# EAGLE design page1 (EAGLE 7.0.0)
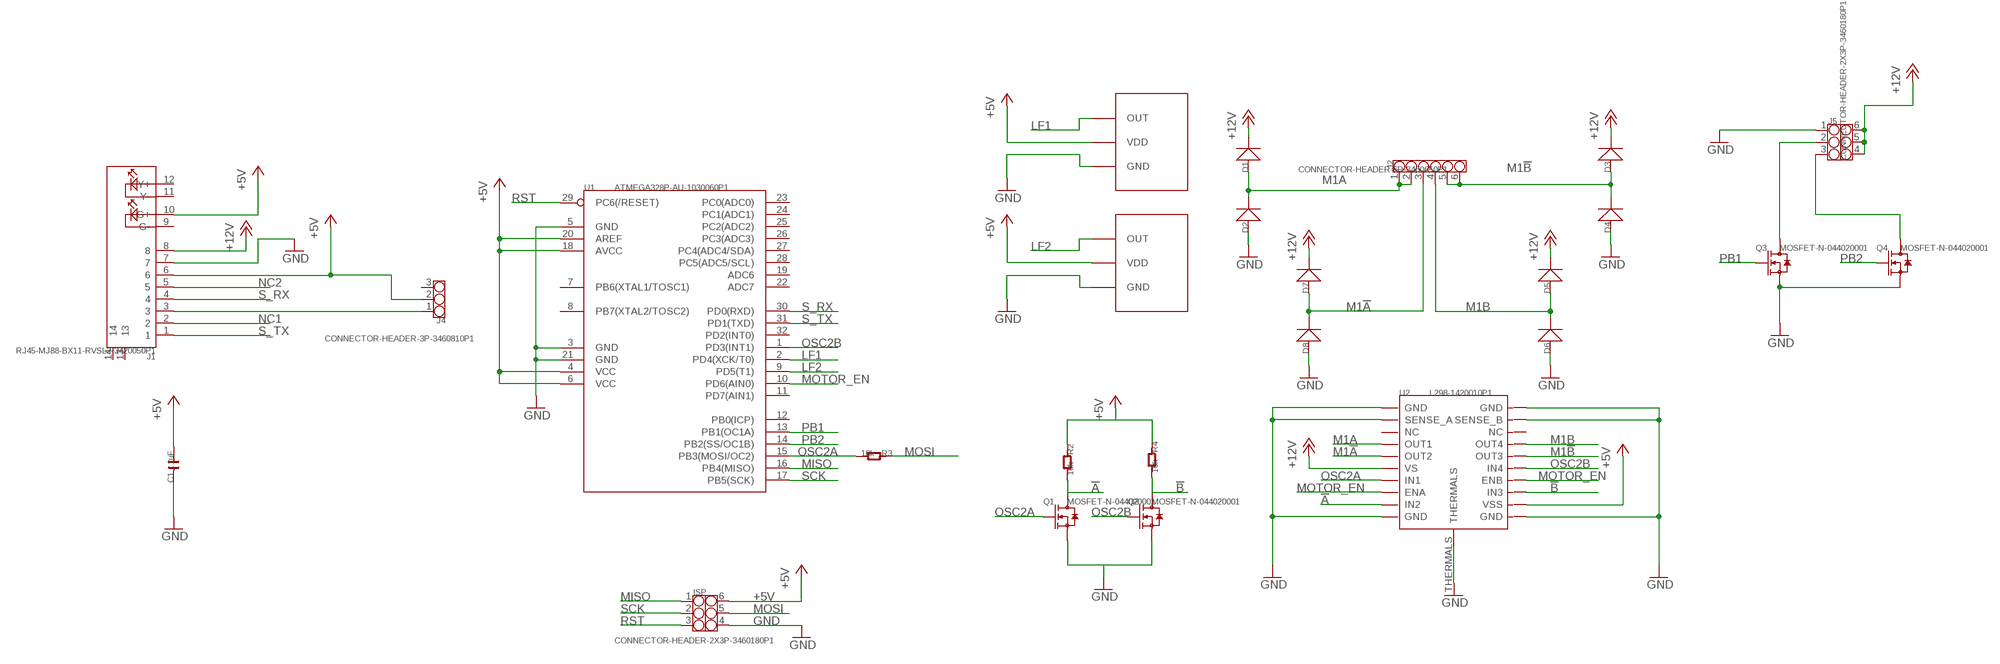
[diagram p0: schematic, sheet 1]

## Parts
C1  1uF  C-0805  [C0805]
D1  D-SMA  [DO-214AC]
D2  D-SMA  [DO-214AC]
D3  D-SMA  [DO-214AC]
D4  D-SMA  [DO-214AC]
D5  D-SMA  [DO-214AC]
D6  D-SMA  [DO-214AC]
D7  D-SMA  [DO-214AC]
D8  D-SMA  [DO-214AC]
ISP  CONNECTOR-HEADER-2X3P-3460180P1  [2X3P-2.54-2.54-11.6-3.0-BLACK-MALE]
J1  RJ45-MJ88-BX11-RVSL2-3420050P1  [RJ45-MJ88-BX11-RVSL2]
J2  CONNECTOR-HEADER-6P-3460650P1  [1X6P-2.54-2.54-11.6-3.0-BLACK-MALE]
J4  CONNECTOR-HEADER-3P-3460810P1  [1X3P-2.54-2.54-11.6-3.0-BLACK-MALE]
J5  CONNECTOR-HEADER-2X3P-3460180P1  [2X3P-2.54-2.54-11.6-3.0-BLACK-MALE]
Q1  MOSFET-N-044020001  [SOT23]
Q2  MOSFET-N-044020001  [SOT23]
Q3  MOSFET-N-044020001  [SOT23]
Q4  MOSFET-N-044020001  [SOT23]
R2  10k  R-0603  [R0603]
R3  10k  R-0603  [R0603]
R4  10k  R-0603  [R0603]
U1  ATMEGA328P-AU-1030060P1  [TQFP32]
U2  L298-1420010P1  [POWERSO-20]
U$5  TSL235  [TSL235R-2MM-S]
U$6  TSL235  [TSL235R-2MM-S]

## Nets
!A: Q1.3(D) R2.2 U2.9(IN2)
!B: Q2.3(D) R4.2 U2.13(IN3)
+5V [pwr12]: C1.2 ISP.6 J1.6 J1.10(G+) J4.2 R2.1 R4.1 U1.4(VCC) U1.6(VCC) U1.18(AVCC) U1.20(AREF) U2.12(VSS) U$5.P$2(VDD) U$6.P$2(VDD)
+12V [pwr12]: D1.2(-) D3.2(-) D5.2(-) D7.2(-) J1.8 J5.4 J5.5 J5.6 U2.6(VS)
GND: C1.1 D2.1(+) D4.1(+) D6.1(+) D8.1(+) ISP.4 J1.7 J5.1 Q1.2(S) Q2.2(S) Q3.2(S) Q4.2(S) U1.3(GND) U1.5(GND) U1.21(GND) U2.1(GND) U2.2(SENSE_A) U2.10(GND) U2.11(GND) U2.19(SENSE_B) U2.20(GND) U2.THERMALS U$5.P$1(GND) U$6.P$1(GND)
LF1: U1.2(PD4(XCK/T0)) U$5.P$3(OUT)
LF2: U1.9(PD5(T1)) U$6.P$3(OUT)
M1!A: D7.1(+) D8.2(-) J2.3 U2.5(OUT2)
M1!B: D3.1(+) D4.2(-) J2.5 J2.6 U2.16(OUT3)
M1A: D1.1(+) D2.2(-) J2.1 J2.2 U2.4(OUT1)
M1B: D5.1(+) D6.2(-) J2.4 U2.17(OUT4)
MISO: ISP.1 U1.16(PB4(MISO))
MOSI: ISP.5 R3.1
MOTOR_EN [pwr12]: U1.10(PD6(AIN0)) U2.8(ENA) U2.14(ENB)
N$1: J1.3 J4.1
N$3: J5.3 Q4.3(D)
N$4: J5.2 Q3.3(D)
NC1: J1.2
NC2: J1.5
OSC2A: Q1.1(G) R3.2 U1.15(PB3(MOSI/OC2)) U2.7(IN1)
OSC2B: Q2.1(G) U1.1(PD3(INT1)) U2.15(IN4)
PB1: Q3.1(G) U1.13(PB1(OC1A))
PB2: Q4.1(G) U1.14(PB2(SS/OC1B))
RST: ISP.3 U1.29(PC6(/RESET))
S_RX: J1.4 U1.30(PD0(RXD))
S_TX: J1.1 U1.31(PD1(TXD))
SCK: ISP.2 U1.17(PB5(SCK))
Unconnected: J1.9(G-) J1.11(Y-) J1.12(Y+) J1.13 J1.14 J4.3 U1.7(PB6(XTAL1/TOSC1)) U1.8(PB7(XTAL2/TOSC2)) U1.11(PD7(AIN1)) U1.12(PB0(ICP)) U1.19(ADC6) U1.22(ADC7) U1.23(PC0(ADC0)) U1.24(PC1(ADC1)) U1.25(PC2(ADC2)) U1.26(PC3(ADC3)) U1.27(PC4(ADC4/SDA)) U1.28(PC5(ADC5/SCL)) U1.32(PD2(INT0)) U2.3(NC) U2.18(NC)

## Library data of the parts
C1 = OPL Eagle Library:C*
D1-D8 = OPL Eagle Library:D*: DIODE
ISP J5 = OPL Eagle Library:CONNECTOR-HEADER-2X3P
J1 = OPL Eagle Library:RJ45-MJ88-BX11-RVSL2: Modular Jack 8P8C,R/A,With LED When you use the footprint ,place notice 46 (layer)milling ,there is some important information.
J2 = OPL Eagle Library:CONNECTOR-HEADER-6P
J4 = OPL Eagle Library:CONNECTOR-HEADER-3P
Q1-Q4 = OPL Eagle Library:MOSFET-N: CJ2302：SMD MOSFET N-CH 20V-2.1A
R2-R4 = OPL Eagle Library:R*
U1 = OPL Eagle Library:ATMEGA328P-AU: 8-bit AVR Microcontroller with 32K Bytes In-System Programmable Flash
U2 = OPL Eagle Library:L298: Dual Full-Bridge Driver http://www.sandorobotics.com/attachments/l298motores.pdf
U$5 U$6 = Chris_parts:TSL235

## Net classes
0 default: width 0.254 mm, clearance 0.254 mm
1 pwr12: width 0.305 mm, drill 0.61 mm, clearance 0.254 mm

## Board
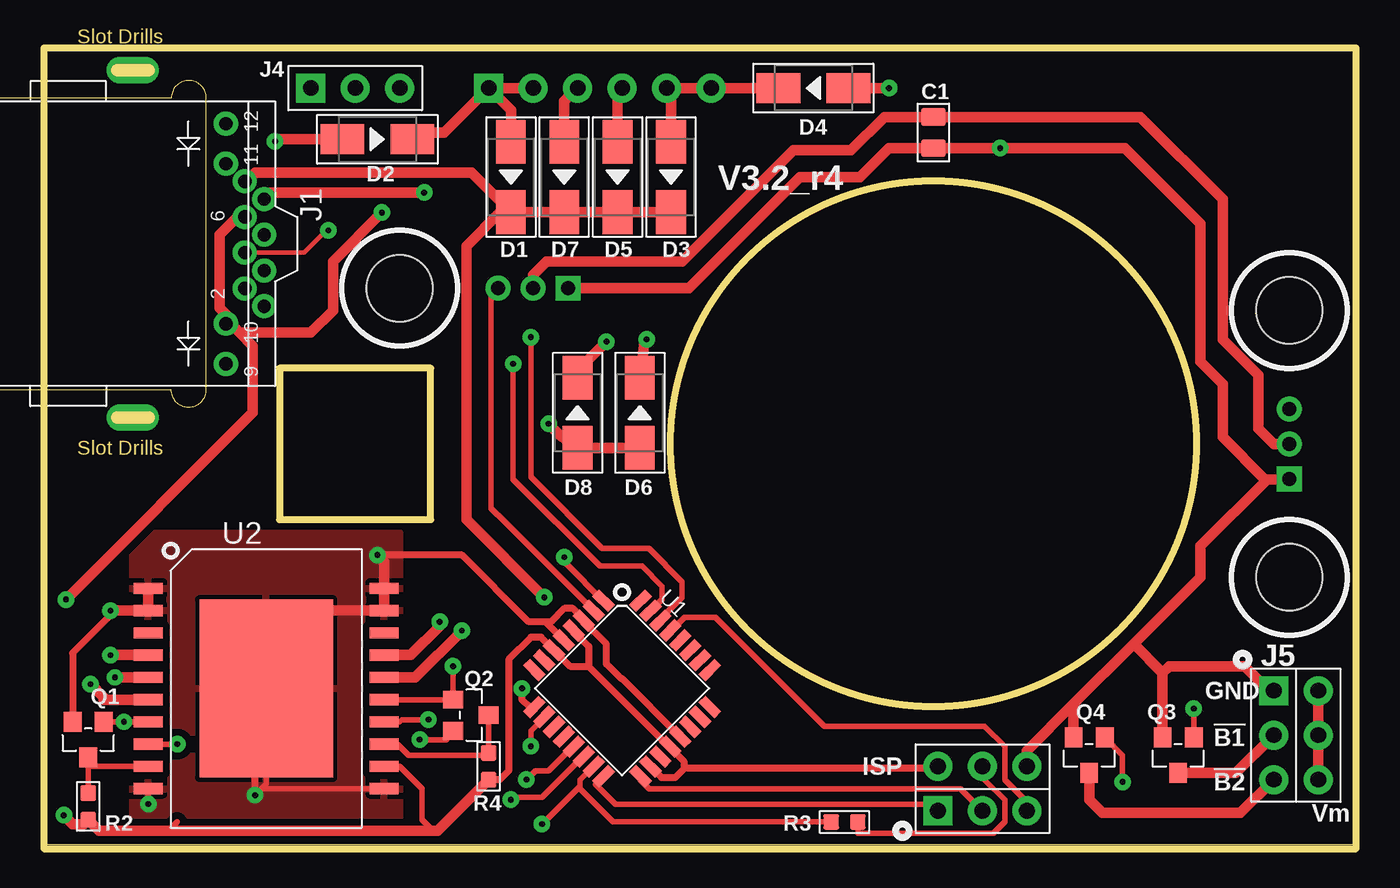
[diagram p1: board, top side]
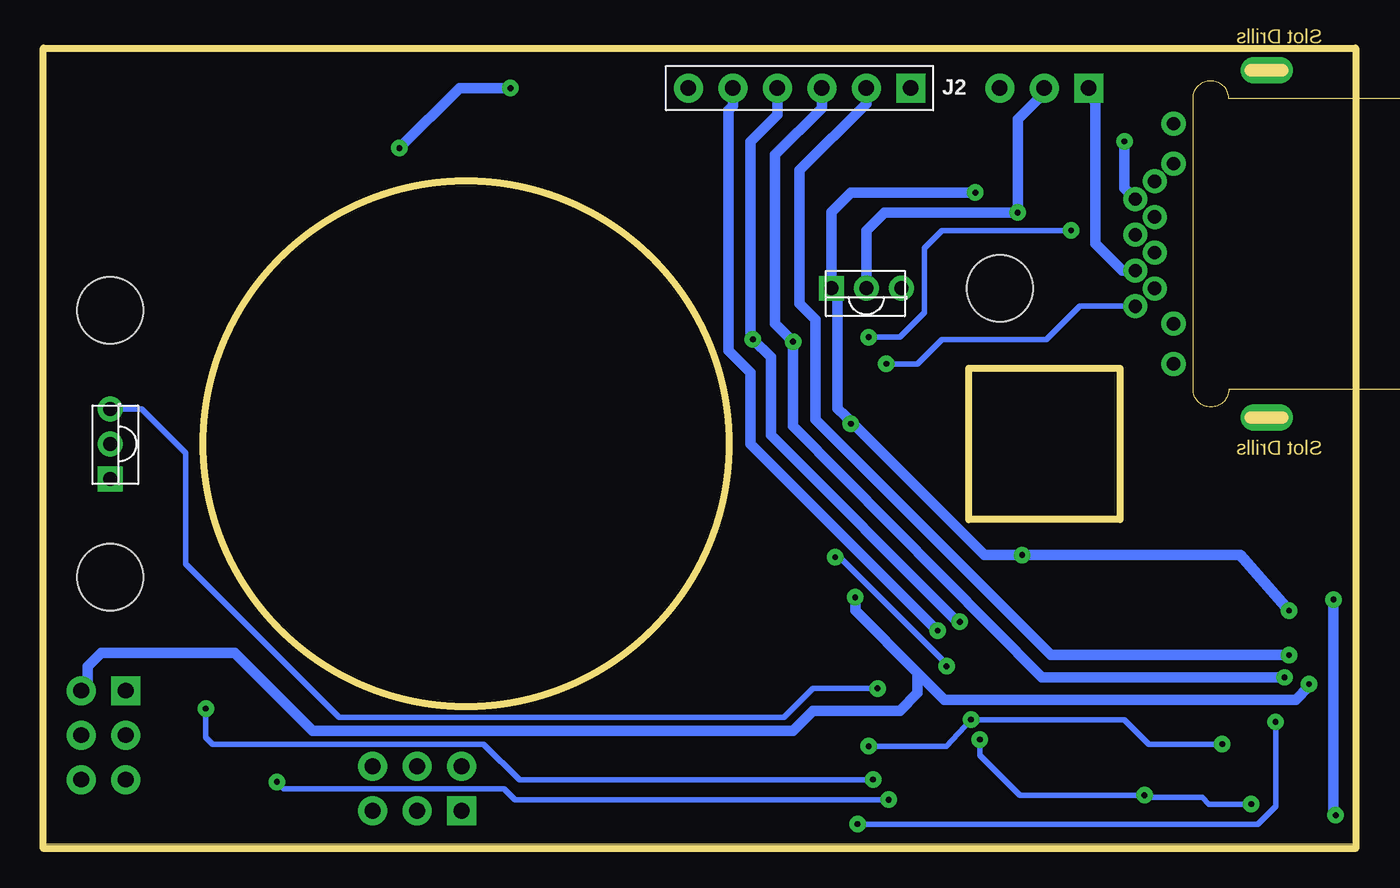
[diagram p2: board, bottom side, seen from below]

Size 74.91 x 45.39 mm. Coordinates in mm from the lower left corner, seen from the top.
Outline: 0,0 74.91,0 74.91,45.39 0,45.39 0,0
Copper layers (1*2*15*16): Top 0.035mm / dielectric 0.2mm / Route2 0.0175mm / dielectric 1.1mm / Route15 0.0175mm / dielectric 0.2mm / Bottom 0.035mm
Design rules "SeeedStudio_DRU_no_angle_20130527 *": minimum track width 6mil, minimum drill 12mil, track to track 6mil, track to pad 6mil, pad to pad 6mil, via to via 6mil, smd to smd 0mil, copper to edge 10mil, drill to drill 10mil, minimum pad ring 12mil, minimum via ring 12mil, stop-mask expansion 2mil, vias tented up to drill 25mil, thermal gap 10mil
Holes 3.8 mm at 20.32,31.75 71.12,30.48 71.12,15.24
Milling: area 35.8,7.9 to 65.8,37.9; 8 lines

### Footprints (pad centres in the part's own frame; a part is rotated, then mirrored left to right if it is on the bottom)
C0805 = smd 1.016 x 1.397: 1 -0.889,0; 2 0.889,0
DO-214AC = smd 2.5 x 1.7: 1 -2,0; 2 2,0
2X3P-2.54-2.54-11.6-3.0-BLACK-MALE = drill 0.889 pad 1.651 square: 1 -1.27,2.54 | drill 0.889 pad 1.651: 2 -1.27,0; 3 -1.27,-2.54; 4 1.27,-2.54; 5 1.27,0; 6 1.27,2.54
RJ45-MJ88-BX11-RVSL2 = drill 0.762 pad 1.27: 1 3.57,7.5; 2 2.55,6.4; 3 1.53,7.5; 4 0.51,6.4; 5 -0.51,7.5; 6 -1.53,6.4; 7 -2.55,7.5; 8 -3.57,6.4; 9 6.86,5.32; 10 4.57,5.32; 11 -4.57,5.32; 12 -6.86,5.32 | drill 0.6 pad 1.5 long: 13 -9.92,0; 14 9.92,0
1X6P-2.54-2.54-11.6-3.0-BLACK-MALE = drill 0.889 pad 1.651 square: 1 0,6.35 | drill 0.889 pad 1.651: 2 0,3.81; 3 0,1.27; 4 0,-1.27; 5 0,-3.81; 6 0,-6.35
1X3P-2.54-2.54-11.6-3.0-BLACK-MALE = drill 0.889 pad 1.651 square: 1 0,2.54 | drill 0.889 pad 1.651: 2 0,0; 3 0,-2.54
SOT23 = smd 1.016 x 1.143: 1 -0.889,-1.016; 2 0.889,-1.016; 3 0,1.016
R0603 = smd 0.889 x 0.889: 1 -0.762,0; 2 0.762,0
TQFP32 = smd 1.27 x 0.559: 1 -4.293,2.8; 2 -4.293,2; 3 -4.293,1.2; 4 -4.293,0.4; 5 -4.293,-0.4; 6 -4.293,-1.2; 7 -4.293,-2; 8 -4.293,-2.8; 17 4.293,-2.8; 18 4.293,-2; 19 4.293,-1.2; 20 4.293,-0.4; 21 4.293,0.4; 22 4.293,1.2; 23 4.293,2; 24 4.293,2.8 | smd 0.559 x 1.27: 9 -2.8,-4.293; 10 -2,-4.293; 11 -1.2,-4.293; 12 -0.4,-4.293; 13 0.4,-4.293; 14 1.2,-4.293; 15 2,-4.293; 16 2.8,-4.293; 25 2.8,4.293; 26 2,4.293; 27 1.2,4.293; 28 0.4,4.293; 29 -0.4,4.293; 30 -1.2,4.293; 31 -2,4.293; 32 -2.8,4.293
POWERSO-20 = smd 1.651 x 0.635: 1 -6.731,5.715; 2 -6.731,4.445; 3 -6.731,3.175; 4 -6.731,1.905; 5 -6.731,0.635; 6 -6.731,-0.635; 7 -6.731,-1.905; 8 -6.731,-3.175; 9 -6.731,-4.445; 10 -6.731,-5.715; 11 6.731,-5.715; 12 6.731,-4.445; 13 6.731,-3.175; 14 6.731,-1.905; 15 6.731,-0.635; 16 6.731,0.635; 17 6.731,1.905; 18 6.731,3.175; 19 6.731,4.445; 20 6.731,5.715 | smd 7.62 x 10.16: THERMALS 0,0
TSL235R-2MM-S = drill 0.8 square: P$1 -2,0 | drill 0.8 pad 1.422: P$2 0,0; P$3 2,0

### Placement (x,y rotation side)
C1  50.8,40.64 90 top
D1  26.67,38.1 270 top
D2  19.05,40.26 0 top
D3  35.81,38.1 270 top
D4  43.94,43.18 180 top
D5  32.77,38.1 270 top
D6  34.04,24.64 90 top
D7  29.72,38.1 270 top
D8  30.48,24.64 90 top
ISP  53.59,3.17 90 top
J1  5.08,34.29 270 top
J2  31.75,43.18 270 bottom
J4  17.78,43.18 90 top
J5  71.5,6.22 0 top
Q1  2.54,5.97 180 top
Q2  24.38,7.37 270 top
Q3  64.77,5.08 180 top
Q4  59.69,5.08 180 top
R2  2.54,2.16 90 top
R3  45.72,1.27 180 top
R4  25.4,4.45 90 top
U1  33.02,8.89 315 top
U2  12.7,8.89 0 top
U$5  27.94,31.75 0 bottom
U$6  71.12,22.86 90 bottom

### Tracks (layer width: path | path; a pad name or v marks a point on that pad's centre or on a via)
!A
  Top 0.305: Q1.3 2.54,4.45 | R2.2 2.54,3.94 2.54,4.45 | U2.9 2.54,4.45
!B
  Top 0.305: Q2.3 R4.2 25.02,5.08 20.83,5.08 20.19,5.71 U2.13
+5V  (via drill 0.33)
  Top 0.305: J1.6 | 10.67,29.72 J1.10 | U2.12 20.32,4.45 21.59,3.17 21.59,1.4 22.23,0.76 | 7.62,1.27 7.11,0.76
  Top 0.406: 31.11,10.16 30.05,10.16 U1.6 28.4,11.81 27.81,11.81 26.54,10.54 26.54,4.19 26.04,3.68 R4.1 25.53,3.81 | U1.18 35.27,3.81 36.07,3.81 36.58,4.32 | 36.58,4.32 36.58,4.7 35.77,5.5 U1.20 35.7,5.57 31.11,10.16 | U1.4 30.21,12.21 31.11,11.3 31.11,10.16 | 36.58,4.32 50.93,4.32 ISP.6
  Top 0.61: J1.6 11.05,35.81 10.03,34.8 10.03,30.61 10.4,30.24 J1.10 | U$6.P$2 70.23,22.86 69.34,23.75 69.34,26.8 67.31,28.83 67.31,36.83 62.61,41.53 C1.2 48.01,41.53 46.1,39.62 42.8,39.62 36.45,33.27 28.7,33.27 27.94,32.51 U$5.P$2 | 10.67,29.72 11.18,29.21 | 11.18,29.21 15.24,29.21 16.51,30.48 16.51,33.27 v19.3,36.07 | 11.18,29.21 11.94,28.45 11.94,24.64 v1.27,13.97 | R4.1 22.48,0.76 22.23,0.76 7.11,0.76 3.17,0.76 R2.1 2.29,1.14 1.65,1.14 v1.14,1.65
  Bottom 0.61: U$5.P$2 27.94,35.05 26.92,36.07 v19.3,36.07 19.3,41.4 18.03,42.67 J4.2 | v1.27,13.97 1.27,1.91 v1.14,1.65
+12V  (via drill 0.33, 0.33 pad 0.25)
  Top 0.61: D7.2 D1.2 24.42,38.35 12.06,38.35 11.57,37.86 J1.8 | D7.2 D5.2 D3.2 | J5.6 J5.5 J5.4 | D7.2 26.07,36.1 24.13,34.16 24.13,18.54 v28.57,14.1 | v2.67,9.14 3.43,8.38 3.43,8.26 U2.6
  Bottom 0.61: v28.57,14.1 28.57,13.34 25.02,9.78 | 25.02,9.78 25.02,8.64 26.04,7.62 30.99,7.62 32.13,6.48 59.56,6.48 64.01,10.92 71.63,10.92 72.39,10.16 72.39,9.14 J5.6 | 25.02,9.78 23.5,8.26 3.43,8.26 2.67,9.02 v2.67,9.14
GND  (via drill 0.33)
  Top 0.305: v5.97,2.29 U2.10 | U2.THERMALS 12.7,3.43 v12.06,2.79 12.45,3.17 U2.11 | Q2.2 22.99,5.97 v21.46,5.97 | U1.21 36.41,6.14
  Top 0.406: 29.63,11.64 U1.5 28.64,12.7 | U1.21 33.02,9.46 32.96,9.46 32.13,10.29 32.13,11.43 30.83,12.73 U1.3 | U1.3 30.91,12.77 | U1.3 30.83,12.86 30.23,13.46 29.72,13.46 28.96,12.7 28.64,12.7 | 28.64,12.7 27.69,12.7 23.88,16.51 v19.05,16.51 | v12.06,2.79 12.06,4.45 10.16,6.35 | v3.81,13.34 3.81,13.08 1.65,10.92 Q1.2
  Top 0.61: J1.7 12.95,37.21 v21.72,37.21 | v19.05,16.51 19.43,16.13 U2.20 U2.19 16.13,13.34 12.7,10.16 U2.THERMALS | U2.1 U2.2 v3.81,13.34 | Q1.2 1.78,7.11 | U$6.P$1 71.09,20.83 69.85,20.83 | 69.85,20.83 69.72,20.83 67.31,23.24 67.31,26.29 66.04,27.56 66.04,35.43 61.72,39.75 v54.61,39.75 C1.1 48.26,39.75 46.61,38.1 43.18,38.1 36.83,31.75 U$5.P$1 | D2.1 13.34,40.26 v13.21,40.13 | D4.1 v48.26,43.18 | v28.83,24 29.43,23.4 D8.1 D6.1 | ISP.4 56.13,5.33 58.8,8 | 58.8,8 62.23,11.43 | 62.23,11.43 66.04,15.24 66.04,17.02 69.85,20.83 | Q3.2 63.88,9.78 | 63.88,9.78 62.23,11.43 | Q4.2 58.8,8 | J5.1 69.98,8.76 68.58,10.16 64.26,10.16 63.88,9.78
  Bottom 0.305: 11.94,2.67 8.76,2.67 8.38,2.29 v5.97,2.29 | v21.46,5.97 21.46,5.08 19.18,2.79 v12.06,2.79
  Bottom 0.406: 11.94,2.67 12.06,2.67 v12.06,2.79
  Bottom 0.61: v21.72,37.21 28.83,37.21 29.94,36.1 U$5.P$1 29.59,31.4 29.59,24.89 29.15,24.45 | 29.15,24.45 21.21,16.51 v19.05,16.51 6.6,16.51 v3.81,13.34 | v13.21,40.13 13.21,37.47 J1.7 | v48.26,43.18 51.18,43.18 v54.61,39.75 | v28.83,24 29.15,24.45
  pour Top (isolate 0.406): 5.08,17.78 20.32,17.78 20.32,1.27 5.08,1.27
LF1
  Top 0.305: U1.2 25.94,18.8 25.91,18.8 25.53,19.18 25.53,31.34 U$5.P$3
LF2  (via drill 0.33)
  Top 0.406: U1.9 27.73,7.83 27.3,8.26 v27.3,8.89
  Bottom 0.305: U$6.P$3 69.31,24.86 66.8,22.35 66.8,16 58.04,7.24 32.64,7.24 30.99,8.89 v27.3,8.89
M1!A  (via drill 0.33)
  Top 0.61: U2.5 v4.06,9.53 | D7.1 29.72,42.42 J2.3 | D8.2 30.83,27.4 v32.13,28.7
  Bottom 0.61: v4.06,9.53 17.91,9.53 32.13,23.88 v32.13,28.7 33.15,29.72 33.15,39.37 30.48,42.04 J2.3
M1!B  (via drill 0.33)
  Top 0.61: U2.16 21.21,9.53 v23.88,12.19 | D4.2 J2.6 J2.5 35.81,42.93 D3.1
  Bottom 0.61: v23.88,12.19 34.54,22.86 34.54,26.92 35.81,28.19 35.81,41.91 35.56,42.16 J2.5
M1A  (via drill 0.33)
  Top 0.61: U2.4 v3.81,10.79 | D1.1 26.67,41.91 J2.1 | D2.2 21.43,40.64 22.86,40.64 J2.1 | J2.2 J2.1
  Bottom 0.61: v3.81,10.79 17.4,10.79 30.86,24.26 30.86,29.97 31.75,30.86 31.75,38.48 27.94,42.29 J2.2
M1B  (via drill 0.33)
  Top 0.61: U2.17 20.95,10.79 22.61,12.45 v22.61,12.7 | D6.2 34.29,28.7 v34.42,28.83 | D5.1 32.77,42.93 J2.4
  Bottom 0.61: v22.61,12.7 22.73,12.7 33.4,23.37 33.4,27.81 v34.42,28.83 34.54,29.21 34.54,40.13 33.02,41.66 J2.4
MISO
  Top 0.305: U1.16 31.94,3.88 31.5,3.43 32.64,2.29 50.67,2.29
  Top 0.406: 50.67,2.29 ISP.1
MOSI
  Top 0.305: R3.1 46.48,0.64 54.23,0.64 54.86,1.27 54.86,2.54 53.72,3.68 53.72,4.32 ISP.5
MOTOR_EN  (via drill 0.33)
  Top 0.305: U1.10 28.57,7.23 27.81,6.48 v27.81,5.59 | v21.97,7.11 20.45,7.11 20.32,6.99 U2.14 | U2.8 v7.62,5.71
  Bottom 0.305: v27.81,5.59 23.37,5.59 v21.97,7.11 13.21,7.11 11.81,5.71 v7.62,5.71
N$1
  Bottom 0.61: J4.1 14.86,42.29 14.86,34.29 13.33,32.76 J1.3
N$3
  Top 0.61: J5.3 68.33,1.78 60.45,1.78 59.69,2.54 Q4.3
N$4
  Top 0.61: Q3.3 68.07,4.06 J5.2
OSC2A  (via drill 0.33)
  Top 0.305: U1.15 31.36,4.44 30.61,3.68 30.61,3.3 | 30.61,3.3 30.61,3.17 32.51,1.27 R3.2 | Q1.1 v4.57,6.99 U2.7 | 30.61,3.3 v28.45,1.14
  Bottom 0.305: v28.45,1.14 5.59,1.14 4.57,2.16 v4.57,6.99
OSC2B  (via drill 0.33)
  Top 0.305: U1.1 31.94,13.9 29.84,16 v29.72,16.38 | v23.37,10.16 Q2.1 U2.15
  Bottom 0.305: v29.72,16.38 29.46,16.38 23.62,10.54 23.62,10.41 v23.37,10.16
PB1  (via drill 0.33)
  Top 0.305: U1.13 30.14,5.5 28.83,4.19 28.07,4.19 v27.56,3.68 | v65.66,7.75 Q3.1
  Bottom 0.305: v27.56,3.68 47.75,3.68 49.78,5.71 65.28,5.71 Q3.1 v65.66,7.75
PB2  (via drill 0.33)
  Top 0.305: U1.14 30.79,5.01 28.45,2.67 27.05,2.67 v26.67,2.54 | v61.59,3.56 61.59,5.08 Q4.1
  Bottom 0.305: v26.67,2.54 48.01,2.54 48.64,3.17 61.21,3.17 v61.59,3.56
RST
  Top 0.305: U1.29 35.83,12.21 36.58,12.95 38.35,12.95 44.58,6.73 53.72,6.73 54.86,5.59 54.86,3.68 56.13,2.41 ISP.3
S_RX  (via drill 0.33)
  Top 0.254: J1.4 14.86,33.78 16.13,35.05 v16.26,35.05
  Top 0.305: v27.81,28.96 27.81,20.95 31.88,16.89 34.54,16.89 36.45,14.99 36.45,14.1 35.21,12.86 U1.30
  Bottom 0.305: v27.81,28.96 26.04,28.96 24.64,30.35 24.64,34.04 23.62,35.05 v16.26,35.05
S_TX  (via drill 0.33)
  Top 0.305: v26.8,27.43 26.8,20.83 31.75,15.88 34.16,15.88 35.31,14.73 35.31,13.97 34.68,13.34 U1.31
  Bottom 0.305: J1.1 12.59,30.73 15.75,30.73 17.65,28.83 23.62,28.83 25.02,27.43 v26.8,27.43
SCK
  Top 0.305: U1.17 34.08,3.64 34.54,3.17 52.32,3.17 ISP.2

### Text on the board
tPlace: V3.2_r4
tNames: GND | !B1 | !B2 | Vm